# EAGLE schematic autofowl (EAGLE 7.7.0)
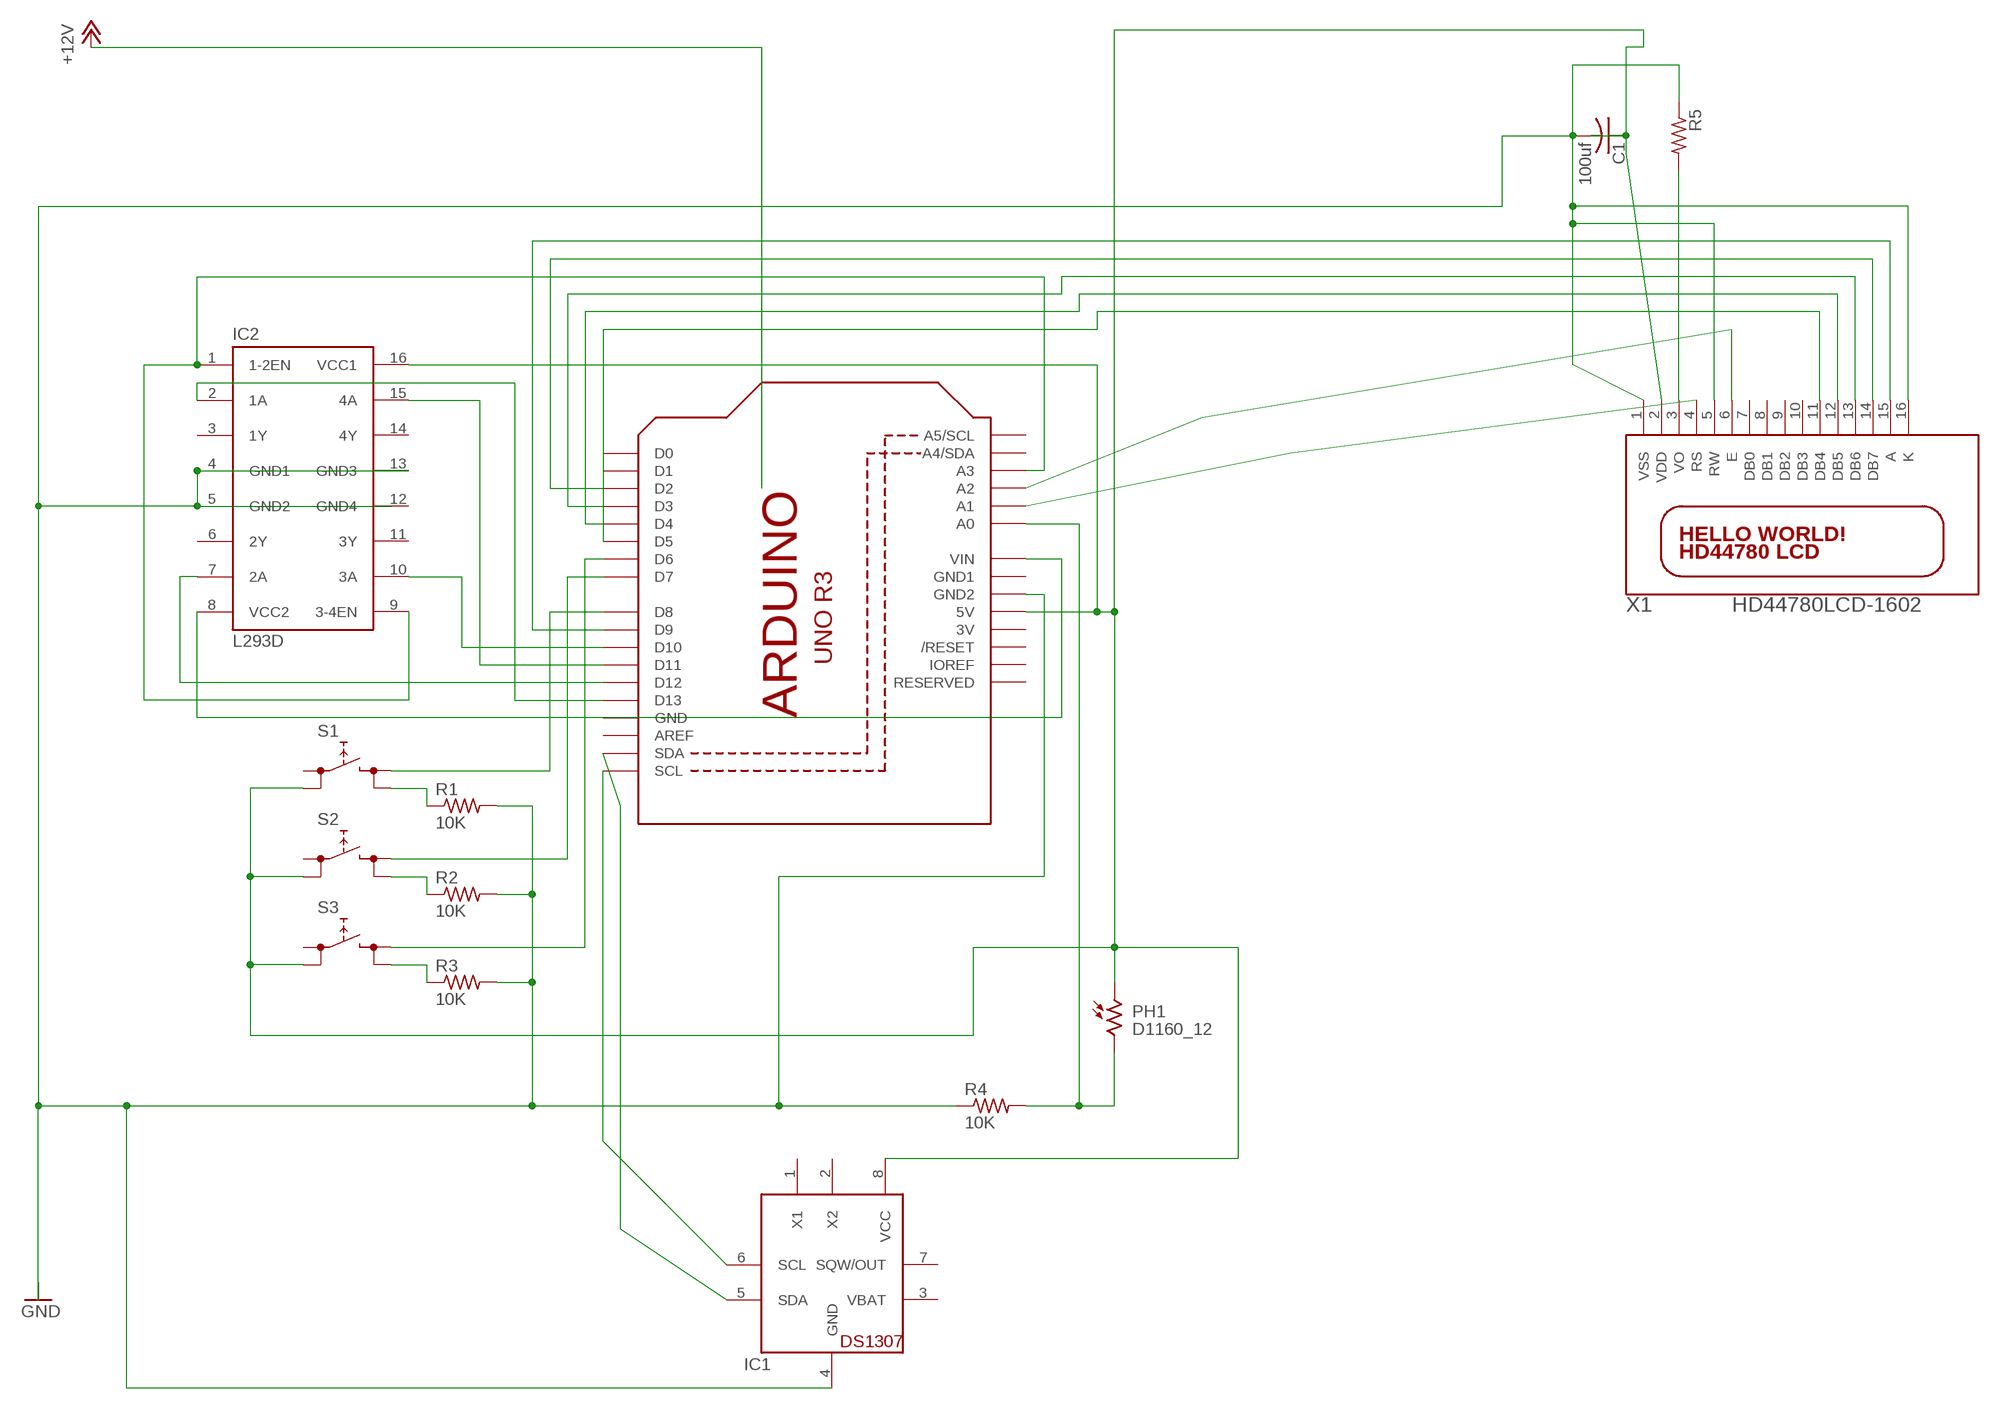
[diagram p0: schematic, sheet 1]

## Parts
C1  100uf  C-US050-024X044  [C050-024X044]
IC1  DS1307  [DIL08]
IC2  L293D  [DIL16]
PH1  D1160_12  [D11XX]
R1  10K  R-US_0309/12  [0309/12]
R2  10K  R-US_0309/12  [0309/12]
R3  10K  R-US_0309/12  [0309/12]
R4  10K  R-US_0309/12  [0309/12]
R5  R-US_0309/12  [0309/12]
S1  REKN  [REKN]
S2  REKN  [REKN]
S3  REKN  [REKN]
U1  ARDUINOR3-DIMENSION  [ARDUINOR3]
X1  HD44780LCD-1602  [LCD1602]

## Nets
+5V: C1.1 IC1.8(VCC) IC2.16(VCC1) PH1.1 S1.0B S2.0B S3.0B U1.5V X1.2(VDD)
DRIVER_ENABLE: IC2.1(1-2EN) IC2.9(3-4EN) U1.A3
GND: C1.2 IC1.4(GND) IC2.4(GND1) IC2.5(GND2) IC2.13(GND3) R1.2 R2.2 R3.2 R4.1 R5.1 U1.GND2 X1.1(VSS) X1.5(RW) X1.16(K)
N$1: R5.2 X1.3(VO)
N$3: IC1.5(SDA) U1.SDA
N$4: IC2.8(VCC2) U1.VIN
N$5: IC2.2(1A) U1.D13
N$6: IC2.7(2A) U1.D12
N$7: IC2.15(4A) U1.D11
N$8: IC2.10(3A) U1.D10
N$9: U1.A1 X1.4(RS)
N$10: U1.A2 X1.6(E)
N$11: IC1.6(SCL) U1.SCL
N$12: R1.1 S1.1B
N$13: U1.D9 X1.15(A)
N$14: U1.D2 X1.14(DB7)
N$15: U1.D3 X1.13(DB6)
N$16: U1.D4 X1.12(DB5)
N$17: U1.D5 X1.11(DB4)
N$18: R2.1 S2.1B
N$19: R3.1 S3.1B
N$21: S1.1A U1.D8
N$22: S2.1A U1.D7
N$23: S3.1A U1.D6
PHOTORESISTOR_INPUT: PH1.2 R4.2 U1.A0
Unconnected: IC1.1(X1) IC1.2(X2) IC1.7(SQW/OUT) IC2.3(1Y) IC2.6(2Y) IC2.11(3Y) IC2.14(4Y) S1.0A S2.0A S3.0A U1.A4(A4/SDA) U1.A5(A5/SCL) U1.AREF U1.D0 U1.D1 U1.IOREF U1.RESERVED U1.RESET(/RESET) X1.7(DB0) X1.8(DB1) X1.9(DB2) X1.10(DB3)

## Power pins joined to a net without a drawn wire
3V: U1.3V
GND: U1.GND
GND1: U1.GND1
GND4: IC2.12(GND4)
VBAT: IC1.3(VBAT)

## Library data of the parts
C1 = adafruit:C-US: CAPACITOR, American symbol
IC1 = adafruit:DS1307: DS1307 Real time clock (RTC) with battery backup ability. Talk to it via i2c
IC2 = st-microelectronics:L293D: PUSH-PULL 4 CHANNEL DRIVER; MPN: L293D; OC_FARNELL: 9589619; OC_NEWARK: 56P8249
PH1 = photo-elements:D11: Photo Sensor Oil Burner Control Applications Source: http://optoelectronics.perkinelmer.com/content/Datasheets/DTS_PhotocellsD1160.pdf
R1-R5 = adafruit:R-US_: RESISTOR, American symbol
S1-S3 = switch:REKN: PUSH SWITCH ITT-Cannon-Cannon
U1 = adafruit:ARDUINOR3: This is a new object for the new Arduino R3 - with extra pins that you may want to use (such as IOref, and duplicated A4/A5
X1 = adafruit:HD44780LCD: HD44780 LCD Standard character type LCDs, available in sizes from 8x1 to 40x4!